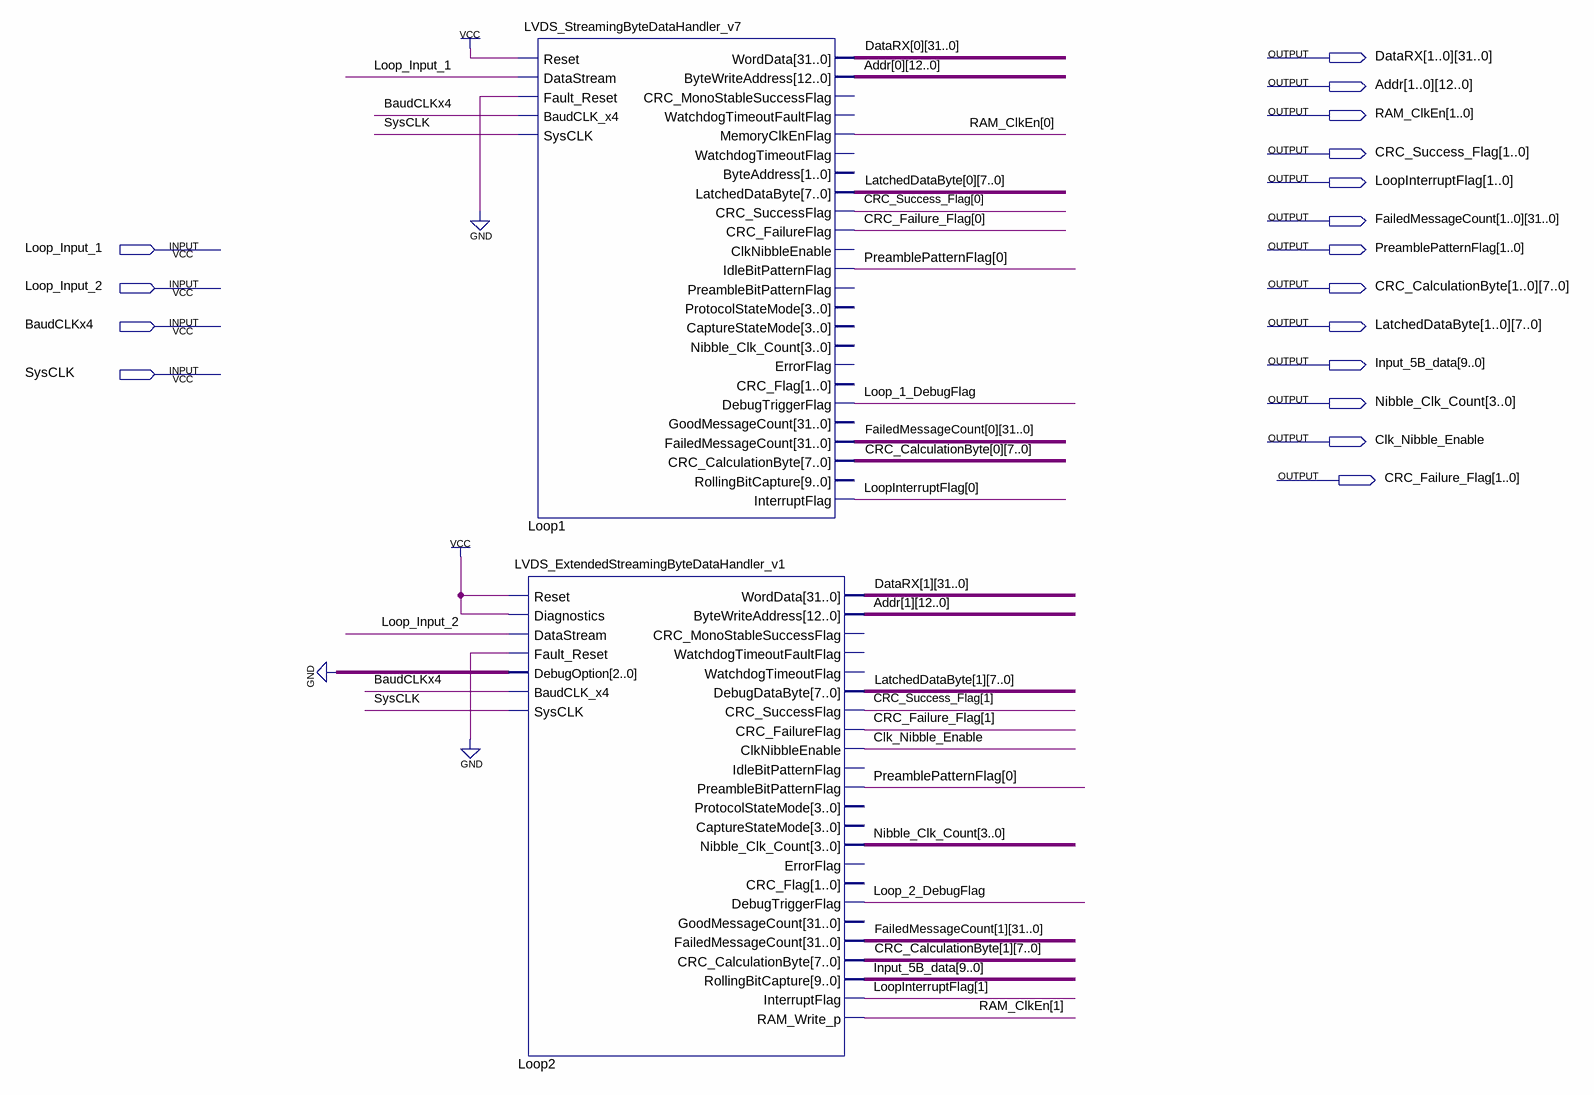
[diagram p0: schematic sheet]
// Quartus schematic DualLoop4B5BChannels.bdf as structural Verilog: 2 symbols, 17 pins
module DualLoop4B5BChannels (
  input  Loop_Input_1,
  input  Loop_Input_2,
  input  BaudCLKx4,
  input  SysCLK,
  output [31:0] DataRX_1,
  output [31:0] DataRX_0,
  output [12:0] Addr_1,
  output [12:0] Addr_0,
  output [1:0] RAM_ClkEn,
  output [1:0] CRC_Success_Flag,
  output [1:0] LoopInterruptFlag,
  output [31:0] FailedMessageCount_1,
  output [31:0] FailedMessageCount_0,
  output [1:0] PreamblePatternFlag,
  output [7:0] CRC_CalculationByte_1,
  output [7:0] CRC_CalculationByte_0,
  output [7:0] LatchedDataByte_1,
  output [7:0] LatchedDataByte_0,
  output [9:0] Input_5B_data,
  output [3:0] Nibble_Clk_Count,
  output Clk_Nibble_Enable,
  output [1:0] CRC_Failure_Flag
);

  wire Loop_1_DebugFlag, Loop_2_DebugFlag;

  LVDS_StreamingByteDataHandler_v7 Loop1 (
    .Reset(1'b1), .DataStream(Loop_Input_1), .Fault_Reset(1'b0), .BaudCLK_x4(BaudCLKx4), .SysCLK(SysCLK),
    .WordData(DataRX_0), .ByteWriteAddress(Addr_0), .MemoryClkEnFlag(RAM_ClkEn[0]),
    .LatchedDataByte(LatchedDataByte_0), .CRC_SuccessFlag(CRC_Success_Flag[0]),
    .CRC_FailureFlag(CRC_Failure_Flag[0]), .IdleBitPatternFlag(PreamblePatternFlag[0]),
    .DebugTriggerFlag(Loop_1_DebugFlag), .FailedMessageCount(FailedMessageCount_0),
    .CRC_CalculationByte(CRC_CalculationByte_0), .InterruptFlag(LoopInterruptFlag[0]));  // open: CRC_MonoStableSuccessFlag, WatchdogTimeoutFaultFlag, WatchdogTimeoutFlag, ByteAddress, ClkNibbleEnable, PreambleBitPatternFlag, ProtocolStateMode, CaptureStateMode, Nibble_Clk_Count, ErrorFlag, CRC_Flag, GoodMessageCount, RollingBitCapture
  LVDS_ExtendedStreamingByteDataHandler_v1 Loop2 (
    .Reset(1'b1), .Diagnostics(1'b1), .DataStream(Loop_Input_2), .Fault_Reset(1'b0), .DebugOption(3'b000),
    .BaudCLK_x4(BaudCLKx4), .SysCLK(SysCLK), .WordData(DataRX_1), .ByteWriteAddress(Addr_1),
    .DebugDataByte(LatchedDataByte_1), .CRC_SuccessFlag(CRC_Success_Flag[1]),
    .CRC_FailureFlag(CRC_Failure_Flag[1]), .ClkNibbleEnable(Clk_Nibble_Enable),
    .PreambleBitPatternFlag(PreamblePatternFlag[0]), .Nibble_Clk_Count(Nibble_Clk_Count),
    .DebugTriggerFlag(Loop_2_DebugFlag), .FailedMessageCount(FailedMessageCount_1),
    .CRC_CalculationByte(CRC_CalculationByte_1), .RollingBitCapture(Input_5B_data),
    .InterruptFlag(LoopInterruptFlag[1]), .RAM_Write_p(RAM_ClkEn[1]));  // open: CRC_MonoStableSuccessFlag, WatchdogTimeoutFaultFlag, WatchdogTimeoutFlag, IdleBitPatternFlag, ProtocolStateMode, CaptureStateMode, ErrorFlag, CRC_Flag, GoodMessageCount
endmodule
